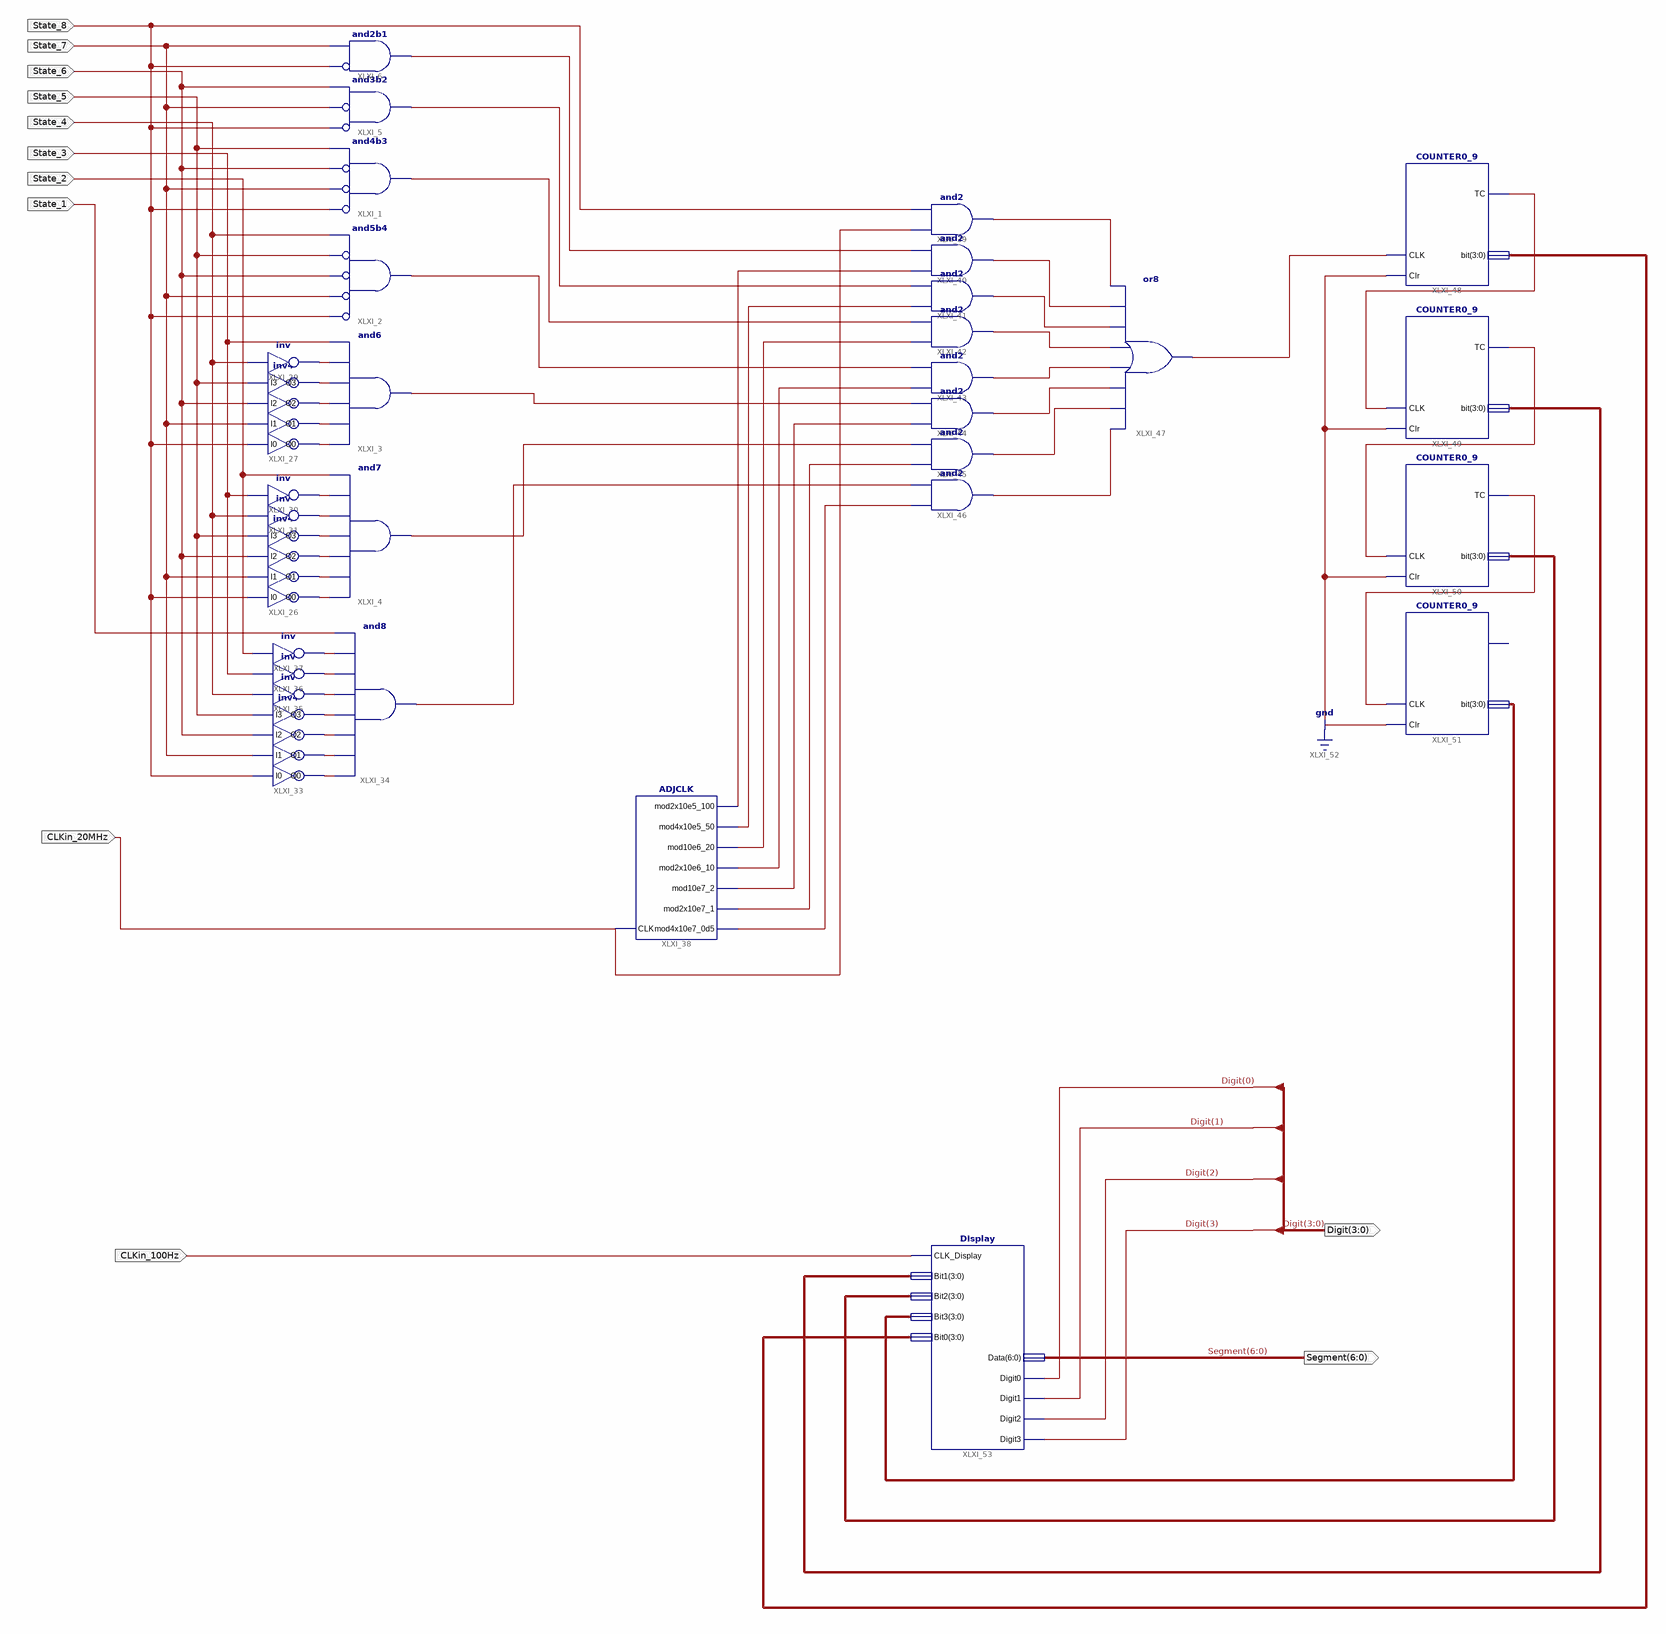
[diagram p0: schematic sheet 1]
// Xilinx ISE schematic moduleLab02.sch (spartan6) as structural Verilog: 31 symbols, 12 ports
module moduleLab02 (
  input  State_4,
  input  State_5,
  input  State_6,
  input  State_7,
  input  State_1,
  input  State_2,
  input  State_3,
  input  State_8,
  input  CLKin_20MHz,
  input  CLKin_100Hz,
  output [3:0] Digit,
  output [6:0] Segment
);

  wire XLXN_1, XLXN_2, XLXN_3, XLXN_4, XLXN_5, XLXN_6, XLXN_7, XLXN_35, XLXN_40, XLXN_41, XLXN_42, XLXN_68,
       XLXN_69, XLXN_70, XLXN_71, XLXN_72, XLXN_73, XLXN_74, XLXN_86, XLXN_87, XLXN_88, XLXN_89, XLXN_90,
       XLXN_91, XLXN_92, XLXN_93, XLXN_102, XLXN_103, XLXN_104, XLXN_105, XLXN_106, XLXN_107, XLXN_108,
       XLXN_111, XLXN_112, XLXN_113, XLXN_114, XLXN_115, XLXN_116, XLXN_117, XLXN_118, XLXN_119, XLXN_120,
       XLXN_121;
  wire [3:0] XLXN_127, XLXN_128, XLXN_129, XLXN_130;

  and XLXI_1 (XLXN_113, ~State_8, ~State_7, ~State_6, State_5);  // and4b3
  and XLXI_2 (XLXN_114, ~State_8, ~State_7, ~State_6, ~State_5, State_4);  // and5b4
  and XLXI_3 (XLXN_115, XLXN_5, XLXN_6, XLXN_7, XLXN_35, XLXN_40, State_3);
  and XLXI_4 (XLXN_116, XLXN_1, XLXN_2, XLXN_3, XLXN_4, XLXN_42, XLXN_41, State_2);
  and XLXI_5 (XLXN_112, ~State_8, ~State_7, State_6);  // and3b2
  and XLXI_6 (XLXN_111, ~State_8, State_7);  // and2b1
  inv4 XLXI_26 (
    .I0(State_8), .I1(State_7), .I2(State_6), .I3(State_5), .O0(XLXN_1), .O1(XLXN_2), .O2(XLXN_3), .O3(XLXN_4));
  inv4 XLXI_27 (
    .I0(State_8), .I1(State_7), .I2(State_6), .I3(State_5), .O0(XLXN_5), .O1(XLXN_6), .O2(XLXN_7),
    .O3(XLXN_35));
  not XLXI_29 (XLXN_40, State_4);
  not XLXI_30 (XLXN_41, State_3);
  not XLXI_31 (XLXN_42, State_4);
  inv4 XLXI_33 (
    .I0(State_8), .I1(State_7), .I2(State_6), .I3(State_5), .O0(XLXN_68), .O1(XLXN_69), .O2(XLXN_70),
    .O3(XLXN_71));
  and XLXI_34 (XLXN_117, XLXN_68, XLXN_69, XLXN_70, XLXN_71, XLXN_72, XLXN_73, XLXN_74, State_1);
  not XLXI_35 (XLXN_72, State_4);
  not XLXI_36 (XLXN_73, State_3);
  not XLXI_37 (XLXN_74, State_2);
  ADJCLK XLXI_38 (
    .CLK(CLKin_20MHz), .mod10e6_20(XLXN_106), .mod10e7_2(XLXN_104), .mod4x10e7_0d5(XLXN_102),
    .mod4x10e5_50(XLXN_107), .mod2x10e7_1(XLXN_103), .mod2x10e5_100(XLXN_108), .mod2x10e6_10(XLXN_105));
  and XLXI_39 (XLXN_86, CLKin_20MHz, State_8);
  and XLXI_40 (XLXN_87, XLXN_108, XLXN_111);
  and XLXI_41 (XLXN_88, XLXN_107, XLXN_112);
  and XLXI_42 (XLXN_89, XLXN_106, XLXN_113);
  and XLXI_43 (XLXN_90, XLXN_105, XLXN_114);
  and XLXI_44 (XLXN_91, XLXN_104, XLXN_115);
  and XLXI_45 (XLXN_92, XLXN_103, XLXN_116);
  and XLXI_46 (XLXN_93, XLXN_102, XLXN_117);
  or XLXI_47 (XLXN_118, XLXN_93, XLXN_92, XLXN_91, XLXN_90, XLXN_89, XLXN_88, XLXN_87, XLXN_86);
  COUNTER0_9 XLXI_48 (.CLK(XLXN_118), .Clr(1'b0), .\bit (XLXN_130), .TC(XLXN_119));
  COUNTER0_9 XLXI_49 (.CLK(XLXN_119), .Clr(1'b0), .\bit (XLXN_129), .TC(XLXN_120));
  COUNTER0_9 XLXI_50 (.CLK(XLXN_120), .Clr(1'b0), .\bit (XLXN_127), .TC(XLXN_121));
  COUNTER0_9 XLXI_51 (.CLK(XLXN_121), .Clr(1'b0), .\bit (XLXN_128));  // open: TC
  DIsplay XLXI_53 (
    .CLK_Display(CLKin_100Hz), .Bit1(XLXN_129), .Bit2(XLXN_127), .Bit3(XLXN_128), .Bit0(XLXN_130),
    .Data(Segment), .Digit0(Digit[0]), .Digit1(Digit[1]), .Digit2(Digit[2]), .Digit3(Digit[3]));
endmodule
